# Altium schematic sheet Out.SchDoc
size A4; SheetNumber: 4; SheetTotal: 7
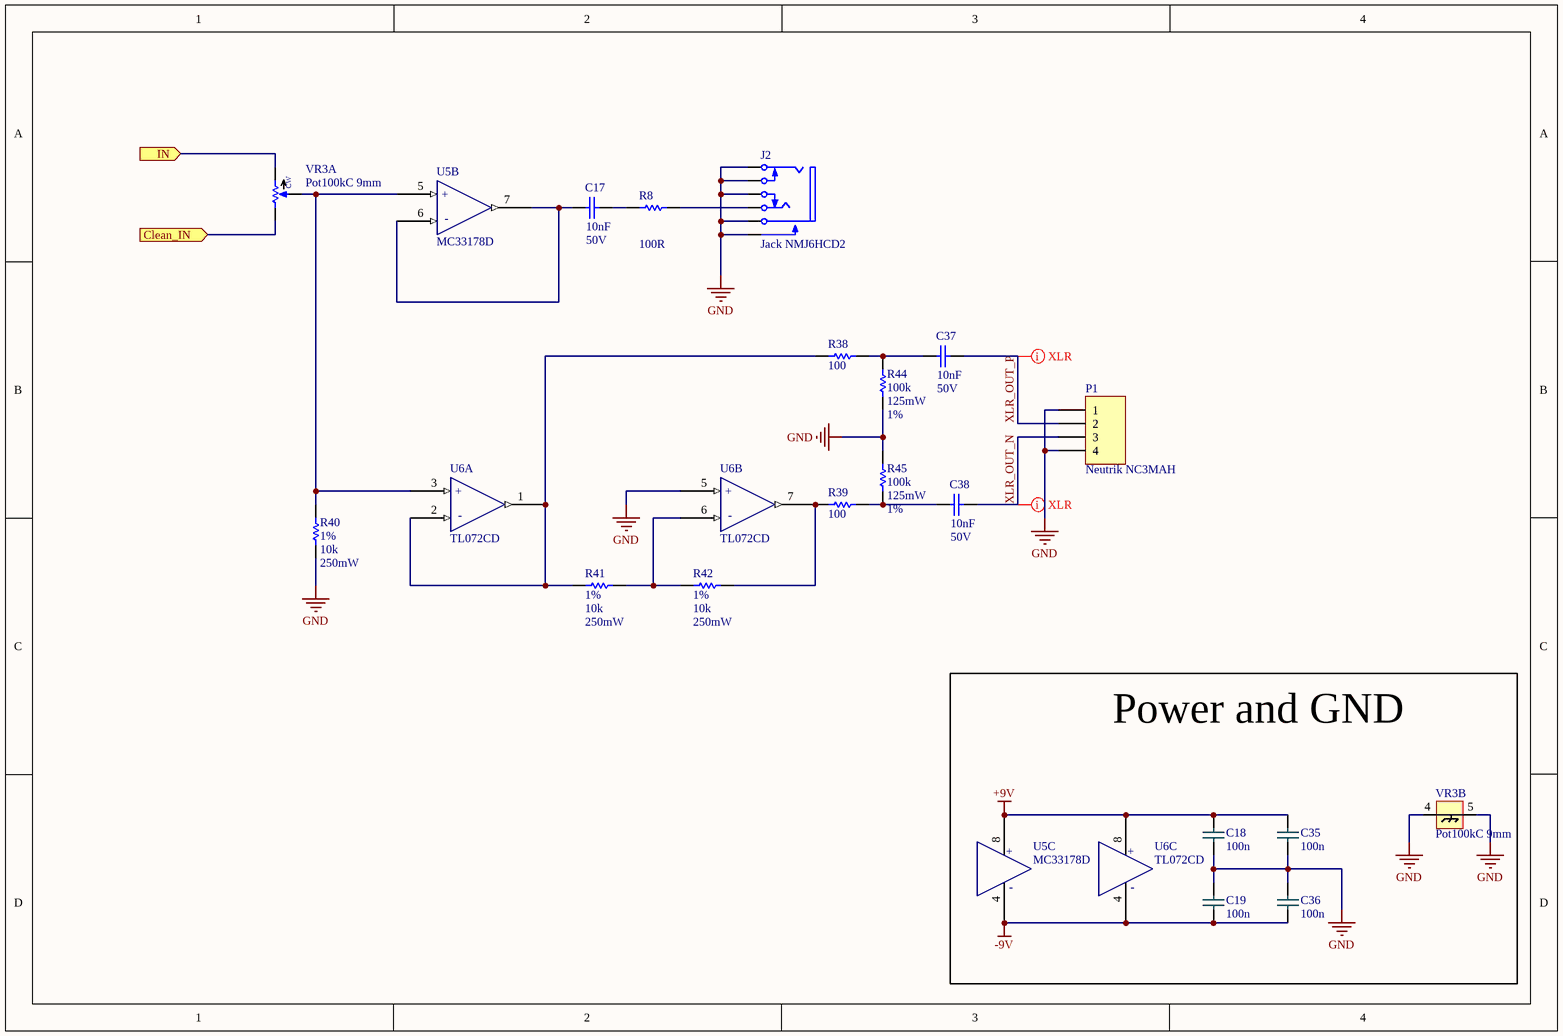
[diagram p0: Out.SchDoc]

## Parts
C17  Capacitance: 10nF  Rated Voltage: 50V  [0805-CAP]  (hidden comment: Cap 10nF 0805 C0G)
C18  value 100n  [0805-CAP]  (hidden comment: Cap 0805 100nF 4)
C19  value 100n  [0805-CAP]  (hidden comment: Cap 0805 100nF 4)
C35  value 100n  [0805-CAP]  (hidden comment: Cap 0805 100nF 4)
C36  value 100n  [0805-CAP]  (hidden comment: Cap 0805 100nF 4)
C37  Capacitance: 10nF  Rated Voltage: 50V  [0805-CAP]  (hidden comment: Cap 10nF 0805 C0G)
C38  Capacitance: 10nF  Rated Voltage: 50V  [0805-CAP]  (hidden comment: Cap 10nF 0805 C0G)
J2  Jack NMJ6HCD2  [Neutrik Jack metal nut]
P1  Neutrik NC3MAH  [NC3MAH-0 XLR]
R8  Resistance: 100R  [0805-RES]  (hidden comment: Res 0805 100R 1%)
R38  Resistance: 100  [1206-RES]  (hidden comment: Res 100R 1% 1206)
R39  Resistance: 100  [1206-RES]  (hidden comment: Res 100R 1% 1206)
R40  Tolerance (+-): 1%  Resistance: 10k  Power: 250mW  [1206-RES]  (hidden comment: Res 10k 1% 1206)
R41  Tolerance (+-): 1%  Resistance: 10k  Power: 250mW  [1206-RES]  (hidden comment: Res 10k 1% 1206)
R42  Tolerance (+-): 1%  Resistance: 10k  Power: 250mW  [1206-RES]  (hidden comment: Res 10k 1% 1206)
R44  Resistance: 100k  Power: 125mW  Tolerance (+-): 1%  [0805-RES]  (hidden comment: Res 100k 1% 0805)
R45  Resistance: 100k  Power: 125mW  Tolerance (+-): 1%  [0805-RES]  (hidden comment: Res 100k 1% 0805)
U5  MC33178D  [SOIC8-127P600X175-8N]  (parts B,C of 3)
U6  TL072CD  [SOIC8-127P600X175-8N]  (parts A,B,C of 3)
VR3  Pot100kC 9mm  [LJV 9mm pot]  (parts A,B of 2)

## Blocks framed on the sheet
Power and GND: C18 C19 C35 C36 U5 U6 VR3

## Ports
Clean_IN (in), IN (in)

## Nets
+9V: C18.2 C35.2 U5.8 U6.8(V+)
-9V: C19.1 C36.1 U5.4 U6.4(V-)
GND: C18.1 C19.2 C35.1 C36.2 J2.1 J2.2 J2.4 J2.5 J2.6 P1.1 P1.4 R40.1 R44.1 R45.2 U6.5(IN+) VR3.4 VR3.5
Clean_IN: VR3.1(CCWPIN) ; port Clean_IN
IN: VR3.3(CWPIN) ; port IN
XLR_OUT_N: C38.2 P1.3
XLR_OUT_P: C37.2 P1.2
NetC17_1: C17.1 U5.6 U5.7
NetC17_2: C17.2 R8.2
NetC37_1: C37.1 R38.1 R44.2
NetC38_1: C38.1 R39.1 R45.1
NetJ2_3: J2.3 R8.1
NetR38_2: R38.2 R41.1 U6.1(OUT) U6.2(IN-)
NetR39_2: R39.2 R42.2 U6.7
NetR40_2: R40.2 U5.5 U6.3(IN+) VR3.2(WIPER)
NetR41_2: R41.2 R42.1 U6.6(IN-)

## Layout directives
differential pair: XLR_OUT_N, XLR_OUT_P

## Notes on the sheet
- (in symbol CMP-028-0012-7, part A) +; -
- (in symbol CMP-028-0012-7, part B) +; -
- (in symbol CMP-028-0012-7, part C) +; -
- (in symbol CMP-028-0053-5, part A) CW
- (in symbol CMP-032-0003-7, part B) +; -
- (in symbol CMP-032-0003-7, part C) +; -

## Library data of the parts
C17 C37 C38 = CMP-04096-2: Cap 10nF 0805 C0G 50V +-5%; Tolerance (+-): 5%; Dielectric: C0G; Maximum operating temperature: 125°C; Height: 950µm; Size (Imperial): 0805
C18 C19 C35 C36 = CMP-019-0144-11: 0.1uF 25volts C0G 5%; Source: main.SchLib; PackageDescription: Chip Capacitor; LatestRevisionNote: IPC-7351 Footprint Added.; LatestRevisionDate: 29-May-2009; Publisher: Altium Limited; Published: 8-Jun-2000; Mouser part: 81-GRM31C5C1E104JA01; Design Item ID: Cap 0805 100nF 4; PackageReference: C1206; Fitted: Fitted
J2 = CMP-028-0060-3: Jack 1/4 stereo switched - PCBH - chrome nut; Manufacturer: Neutrik; Darkglass part: D00-0011; Max Current Rating: 3A; Supplied by Darkglass: YES; Voltage Rating: 50V; Number of Contacts: 2; Number of Ports: 1; Gender: Female; Orientation: Straight; Depth: 18.2mm; ComponentLink3Description: http://datasheet.octopart.com/NMJ6HCD2-Neutrik-datasheet-66533984.pdf?src-supplier=Newark; Package Quantity: 200; ComponentLink1Description: https://datasheet.ciiva.com/16148/210-217181-16148163.pdf?src-supplier=Onlinecomponents.com; Color: Black; Max Operating Temperature: 70°C; Termination: Solder; Design Item ID: Jack NMJ6HCD2; Source: main.SchLib; Mount: Through Hole; Contact Material: Chrome; Number of Terminals: 6; ComponentLink1URL: https://datasheet.ciiva.com/16148/210-217181-16148163.pdf?src-supplier=Onlinecomponents.com; Manufacturer Part Number: NMJ6HCD2; Pricing 1: 1 = 1.74000, 10 = 1.57000, 50 = 1.37000, 100 = 1.32000, 1000 = 1.24000, 10000 = 1.24000 (USD); Weight: 0.282192oz; Selective Soldering: YES; Stock 1: 16927; ComponentLink3URL: http://datasheet.octopart.com/NMJ6HCD2-Neutrik-datasheet-66533984.pdf?src-supplier=Newark; ComponentLink2Description: http://datasheet.octopart.com/NMJ6HCD2-Neutrik-datasheet-46041.pdf?src-supplier=Allied+Electronics; Housing Material: Polyamide; Contact Plating: Silver; Min Operating Temperature: -25°C; ComponentLink2URL: http://datasheet.octopart.com/NMJ6HCD2-Neutrik-datasheet-46041.pdf?src-supplier=Allied+Electronics
P1 = CMP-028-0069-6: Neutrik XLR NC3MAH; Darkglass part: D00-0015; Selective Soldering: Yes; Ratings: IP40; Voltage Rating (DC): 50V; Body Material: Plastic; Current Rating: 6A; Number of Ports: 1; Number of Positions: 3; Approvals: UL; Gender: Male; Contact Plating: Gold; ComponentLink6Description: https://datasheet.ciiva.com/16147/nc3mah-16147837.pdf?src-supplier=Onlinecomponents.com; RoHS: Yes; ComponentLink5URL: https://datasheet.ciiva.com/8007/312284-8007895.pdf?src-supplier=Element14; Number of Terminals: 3; Design Item ID: Neutrik NC3MAH; Stock 1: 3272; Source: main.SchLib; ComponentLink2Description: https://datasheet.ciiva.com/14118/hpnc3mah-14118008.pdf?src-supplier=Distrelec; Length: 25.35mm; ComponentLink1Description: https://datasheet.ciiva.com/23762/312284-23762209.pdf?src-supplier=Newark; ComponentLink6URL: https://datasheet.ciiva.com/16147/nc3mah-16147837.pdf?src-supplier=Onlinecomponents.com; ComponentLink1URL: https://datasheet.ciiva.com/23762/312284-23762209.pdf?src-supplier=Newark; Manufacturer Part Number: NC3MAH; Max Operating Temperature: 80°C; Depth: 22.2mm; Manufacturer: Neutrik; Voltage Rating: 50V; ComponentLink4Description: https://datasheet.ciiva.com/26947/getdatasheetpartid-563979-26947627.pdf?src-supplier=Verical; Weight: 0.246918oz; ComponentLink2URL: https://datasheet.ciiva.com/14118/hpnc3mah-14118008.pdf?src-supplier=Distrelec; ComponentLink4URL: https://datasheet.ciiva.com/26947/getdatasheetpartid-563979-26947627.pdf?src-supplier=Verical; Min Operating Temperature: -30°C; Orientation: Right Angle; Mount: Panel; Contact Material: Brass; Color: Black; Supplied by Darkglass: Yes; Package Quantity: 10; Contact Gender: Male; Pricing 1: 1 = 0,85000, 10 = 0,70700, 50 = 0,70700, 100 = 0,45600, 1000 = 0,36500, 10000 = 0,29600 (USD); Housing Material: Polyamide; ComponentLink3URL: https://datasheet.ciiva.com/11720/0900766b80f3b31a-11720874.pdf?src-supplier=RSComponents; Material: Plastic; REACH SVHC: No SVHC; Termination: Solder; Max Current Rating: 6A; Flammability Rating: UL94 V-0; Number of Contacts: 3; ComponentLink3Description: https://datasheet.ciiva.com/11720/0900766b80f3b31a-11720874.pdf?src-supplier=RSComponents; ComponentLink5Description: https://datasheet.ciiva.com/8007/312284-8007895.pdf?src-supplier=Element14
R8 = CMP-037-0118-8: 100ohm, 125mW, 1%, thin film; Temperature Coefficient: 50ppm/°C; Voltage Rating (DC): 150V; Composition: Thin Film; Case/Package: 0805; Case Code (Imperial): 0805; Case Code (Metric): 2012; ComponentLink1Description: https://datasheet.ciiva.com/2560/pyu-rt-1-to-0-05-rohs-l-5-2560883.pdf?src-supplier=Digi-Key; ComponentLink1URL: https://datasheet.ciiva.com/2560/pyu-rt-1-to-0-05-rohs-l-5-2560883.pdf?src-supplier=Digi-Key; ComponentLink2Description: https://datasheet.ciiva.com/5624/pyu-rt-1-to-0-05-rohs-l-4-5624374.pdf?src-supplier=Mouser; ComponentLink2URL: https://datasheet.ciiva.com/5624/pyu-rt-1-to-0-05-rohs-l-4-5624374.pdf?src-supplier=Mouser; ComponentLink3Description: https://datasheet.ciiva.com/7942/442970-7942070.pdf?src-supplier=Element14; ComponentLink3URL: https://datasheet.ciiva.com/7942/442970-7942070.pdf?src-supplier=Element14; ComponentLink4Description: https://datasheet.ciiva.com/5925/442970-5925320.pdf?src-supplier=Farnell; ComponentLink4URL: https://datasheet.ciiva.com/5925/442970-5925320.pdf?src-supplier=Farnell; Contact Plating: Tin; Depth: 1.25mm; Design Item ID: Res 0805 100R 1%; Features: Moisture Resistant; Height: 0.024inch; LatestRevisionDate: 17-Jul-2002; LatestRevisionNote: Re-released for DXP Platform.; Lead Free: Lead Free; Length: 2mm; Max Operating Temperature: 125°C; Max Power Dissipation: 125mW; Military Standard: Not; Min Operating Temperature: -55°C; Number of Pins: 2; Number of Terminations: 2; PackageDescription: Axial Device, Thru-Hole; 2 Leads; 0.5 in Pin Spacing; Package Quantity: 5000; PackageReference: AXIAL-0.5; Packaging: Tape and Reel; Power Rating: 125mW; Pricing 1: 1 = 0,10000, 10 = 0,09300, 100 = 0,03580, 1000 = 0,01573, 2500 = 0,01358 (USD); Published: 8-Jun-2000; Publisher: Altium Limited; Radiation Hardening: No; REACH SVHC: No SVHC; RoHS: Yes; Source: main.SchLib; Stock 1: 52567; Termination: SMD/SMT; Tolerance: 1%; Value: 100R; Voltage Rating: 150V; Weight: 0.000194oz; Width: 0.049inch
R38 R39 = CMP-03662-2: Resistor 100R +-1% 1206 Thin film 0.25W +-50ppm/°C; Maximum working voltage: 200V; Temperature Coefficient (ppm/°C): 50; Power: 250mW; Size (Imperial): 1206; Tolerance (+-): 1%; Composition: Thin film
R40-R42 = CMP-03860-2: Resistor 10k +-1% 1206 Thin film 0.25W +-50ppm/°C; Maximum working voltage: 200V; Temperature Coefficient (ppm/°C): 50; Size (Imperial): 1206; Composition: Thin film
R44 R45 = CMP-02701-2: Resistor 100k +-1% 0805 Thin film 0.125W +-50ppm/°C; Temperature Coefficient (ppm/°C): 50; Maximum working voltage: 150V; Composition: Thin film; Size (Imperial): 0805
U5 = CMP-032-0003-7: IC OPAMP GP 5MHZ 8SOIC; Manufacturer: ON Semiconductor; Manufacturer Part Number: MC33178DR2G; Slew Rate: 2V/µs; Max Supply Voltage: 18V; Input Bias Current: 500nA; Number of Elements: 2; Output Current: 80mA; Nominal Supply Current: 900uA; Operating Supply Current: 1.7mA; Min Dual Supply Voltage: 2V; Common Mode Rejection Ratio: 80dB; Max Frequency: 100kHz; Input Offset Voltage (Vos): 3mV; Voltage Gain: 106.02dB; Output Current per Channel: 100mA; ComponentLink3Description: https://datasheet.ciiva.com/1796/mc33178-d-1796436.pdf?src-supplier=Digi-Key; Contact Plating: Tin; Packaging: Tape and Reel; ComponentLink4URL: https://datasheet.ciiva.com/8078/89824-8078566.pdf?src-supplier=Element14; ComponentLink1Description: https://datasheet.ciiva.com/30481/0900766b811a6563-30481352.pdf?src-supplier=RSComponents; Number of Pins: 8; Width: 0.157inch; ComponentLink6URL: https://datasheet.ciiva.com/2973/mc33178-d-2973665.pdf?src-supplier=Avnet; Nominal Gain Bandwidth Product: 5MHz; Min Operating Temperature: -40°C; Design Item ID: MC33178D; Lead Free: Lead Free; Max Dual Supply Voltage: 18V; ComponentLink9Description: https://datasheet.ciiva.com/26056/mc33178-d-26056808.pdf?src-supplier=Avnet+Europe; ComponentLink8URL: https://datasheet.ciiva.com/17068/70275428-17068423.pdf?src-supplier=Allied+Electronics; Length: 0.196inch; Gain Bandwidth Product: 5MHz; ComponentLink9URL: https://datasheet.ciiva.com/26056/mc33178-d-26056808.pdf?src-supplier=Avnet+Europe; Stock 1: 25846; Number of Channels: 2; Number of Amplifiers: 2; ComponentLink6Description: https://datasheet.ciiva.com/2973/mc33178-d-2973665.pdf?src-supplier=Avnet; ComponentLink5URL: https://datasheet.ciiva.com/48491/mc33178-d-48491755.pdf?src-supplier=Avnet; Mouser part: 863-MC33178DG; Case/Package: SOIC; Height: 0.059inch; ComponentLink5Description: https://datasheet.ciiva.com/48491/mc33178-d-48491755.pdf?src-supplier=Avnet; ComponentLink2URL: https://datasheet.ciiva.com/1796/mc33178-d-1796435.pdf?src-supplier=Digi-Key; Radiation Hardening: No; ComponentLink2Description: https://datasheet.ciiva.com/1796/mc33178-d-1796435.pdf?src-supplier=Digi-Key; ComponentLink8Description: https://datasheet.ciiva.com/17068/70275428-17068423.pdf?src-supplier=Allied+Electronics; Package Quantity: 1; ComponentLink1URL: https://datasheet.ciiva.com/30481/0900766b811a6563-30481352.pdf?src-supplier=RSComponents; Halogen Free: Halogen Free; Unity Gain Bandwidth Product: 5MHz; ComponentLink3URL: https://datasheet.ciiva.com/1796/mc33178-d-1796436.pdf?src-supplier=Digi-Key; ComponentLink4Description: https://datasheet.ciiva.com/8078/89824-8078566.pdf?src-supplier=Element14; Max Operating Temperature: 85°C; REACH SVHC: No SVHC; ComponentLink7Description: https://datasheet.ciiva.com/1796/mc33178-d-1796437.pdf?src-supplier=Digi-Key; Pricing 1: 1 = 0.86000, 10 = 0.75300, 100 = 0.57700, 500 = 0.45614, 1000 = 0.36492 (USD); ComponentLink7URL: https://datasheet.ciiva.com/1796/mc33178-d-1796437.pdf?src-supplier=Digi-Key; RoHS: Yes; Source: main.SchLib; Bandwidth: 5MHz; Number of Circuits: 2; Power Supply Rejection Ratio (PSRR): 80dB; PartId: 1
U6 = CMP-028-0012-7: Operational Amplifiers - Op Amps Dual Low Noise JFET SOIC8; Manufacturer 1: Texas Instruments; Operating Supply Voltage: 18V; Number of Elements: 2; Bandwidth: 3MHz; Dual Supply Voltage: 9V; Input Bias Current: 200pA; Min Dual Supply Voltage: 3.5V; Voltage Gain: 106.02dB; Max I/O Voltage: 10mV; Common Mode Rejection Ratio: 70dB; Input Offset Voltage (Vos): 3mV; Slew Rate: 13V/µs; Operating Supply Current: 1.4mA; Nominal Supply Current: 5mA; ComponentLink4URL: http://www.farnell.com/datasheets/1862384.pdf?src-supplier=Element14; ComponentLink4Description: http://www.farnell.com/datasheets/1862384.pdf?src-supplier=Element14; Manufacturer Part Number 1: TL072CD; REACH SVHC: No SVHC; Pricing 1: 1 = 0.71000, 10 = 0.59500, 50 = 0.59500, 100 = 0.38400, 1000 = 0.30700, 10000 = 0.25000 (USD); RoHS: Yes; Source: main.SchLib; ComponentLink1URL: http://www.ti.com/general/docs/lit/getliterature.tsp?genericPartNumber=TL072&&fileType=pdf&src-supplier=Avnet; Height: 1.58mm; Gain Bandwidth Product: 3MHz; ComponentLink5URL: http://focus.ti.com/lit/ds/symlink/tl074.pdf?src-supplier=Avnet+Asia; Number of Amplifiers: 2; ComponentLink2Description: https://www.distrelec.biz/Web/Downloads/_t/ds/tl07x-series_eng_tds.pdf?mime=application%2Fpdf&src-supplier=Distrelec; Radiation Hardening: No; ComponentLink3URL: http://www.ti.com/lit/ds/symlink/tl071a.pdf?src-supplier=Digi-Key; Unity Gain Bandwidth Product: 3MHz; Case/Package: D; Max Operating Temperature: 85°C; Packaging: Rail/Tube; Number of Circuits: 2; Number of Pins: 8; Length: 4.9mm; Number of Channels: 2; Package Quantity: 75; Min Operating Temperature: -40°C; Width: 3.91mm; Lead Free: Lead Free; Stock 1: 14514; ComponentLink3Description: http://www.ti.com/lit/ds/symlink/tl071a.pdf?src-supplier=Digi-Key; Nominal Gain Bandwidth Product: 3MHz; ComponentLink5Description: http://focus.ti.com/lit/ds/symlink/tl074.pdf?src-supplier=Avnet+Asia; Max Dual Supply Voltage: 18V; ComponentLink1Description: http://www.ti.com/general/docs/lit/getliterature.tsp?genericPartNumber=TL072&&fileType=pdf&src-supplier=Avnet; ComponentLink2URL: https://www.distrelec.biz/Web/Downloads/_t/ds/tl07x-series_eng_tds.pdf?mime=application%2Fpdf&src-supplier=Distrelec; Design Item ID: TL072CD
VR3 = CMP-028-0053-5: LJV 9mm pot; Darkglass part: D00-0002; Manufacturer Part Number 1: RP09110NOBA-H02-1485 (C104,KA15A6.5); Value: 100kC; Selective Soldering: YES; SET POSITION: 1; Source: main.SchLib; Design Item ID: Pot100kC 9mm; Supplied by Darkglass: YES